# EAGLE design BedLevelSensor (EAGLE 9.6.2)
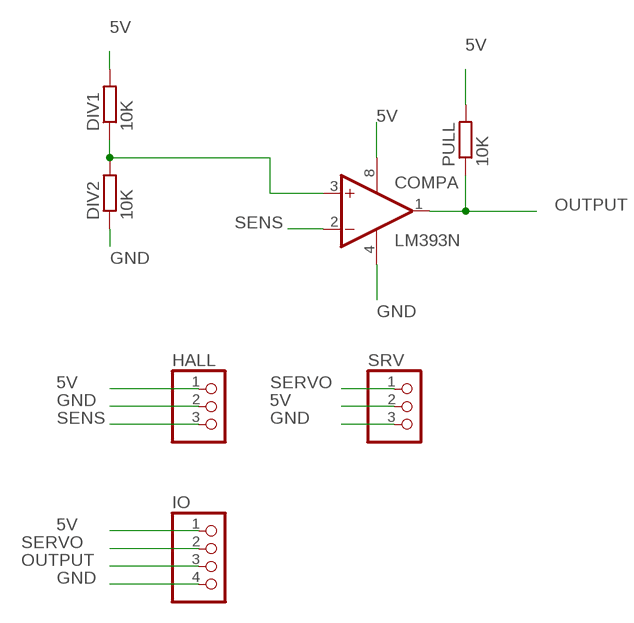
[diagram p0: schematic, sheet 1]

## Parts
COMP  LM393N  [DIL08]
DIV1  10K  R-EU_0204/5  [0204/5]
DIV2  10K  R-EU_0204/5  [0204/5]
HALL  PINHD-1X3  [1X03]
IO  PINHD-1X4  [1X04]
PULL  10K  R-EU_0204/5  [0204/5]
SRV  PINHD-1X3  [1X03]

## Nets
5V: COMP.8(P:V+) DIV1.2 HALL.1 IO.1 PULL.2 SRV.2
GND: COMP.4(P:V-) DIV2.1 HALL.2 IO.4 SRV.3
N$1: COMP.3(A:+IN) DIV1.1 DIV2.2
OUTPUT: COMP.1(A:OUT) IO.3 PULL.1
SENS: COMP.2(A:-IN) HALL.3
SERVO: IO.2 SRV.1
Unconnected: COMP.5(B:+IN) COMP.6(B:-IN) COMP.7(B:OUT)

## Library data of the parts
COMP = linear4:LM393: COMPARATOR
DIV1 DIV2 PULL = rcl:R-EU_: RESISTOR, European symbol; SPICEPREFIX: R
HALL SRV = pinhead:PINHD-1X3: PIN HEADER
IO = pinhead:PINHD-1X4: PIN HEADER

## Board
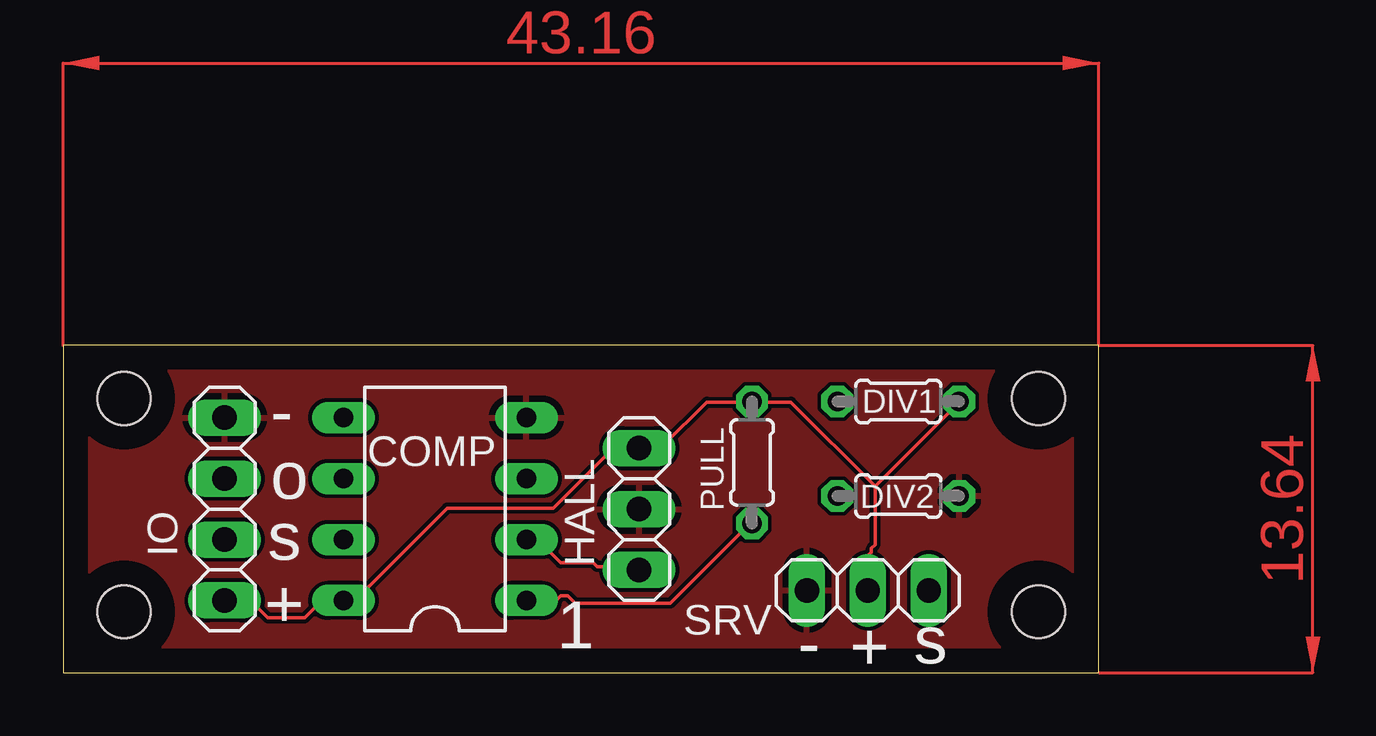
[diagram p1: board, top side]
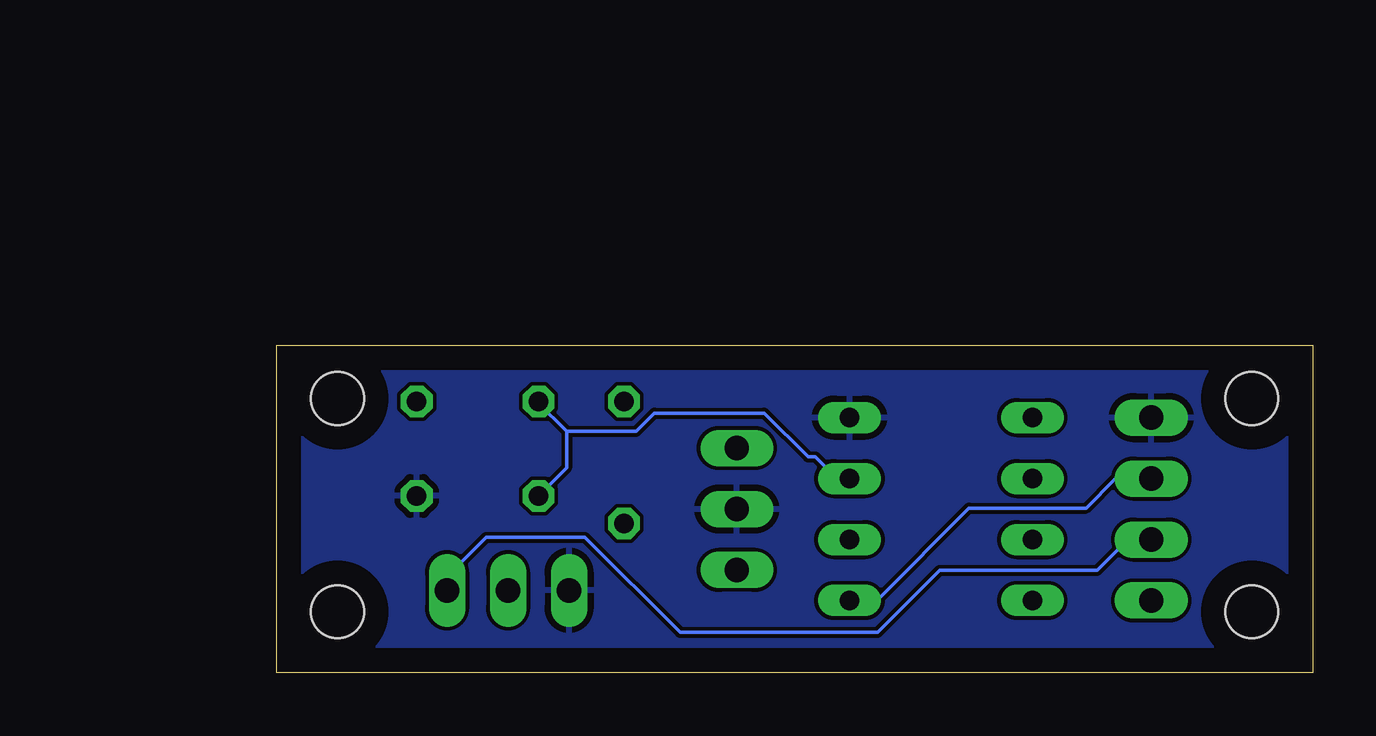
[diagram p2: board, bottom side, seen from below]

Size 43.16 x 13.64 mm. Coordinates in mm from the lower left corner, seen from the top.
Outline: 0,0 43.16,0 43.16,13.64 0,13.64 0,0
Copper layers (1*16): Top 0.035mm / dielectric 1.5mm / Bottom 0.035mm
Design rules "default": minimum track width 6mil, minimum drill 0.35mm, track to track 6mil, track to pad 6mil, pad to pad 6mil, via to via 6mil, smd to smd 6mil, copper to edge 40mil, drill to drill 6mil, minimum pad ring 10mil, minimum via ring 8mil, stop-mask expansion 4mil, vias tented up to drill 0mil, thermal gap 10mil
Holes 2.2 mm at 2.54,11.43 2.54,2.54 40.64,11.43 40.64,2.54

### Footprints (pad centres in the part's own frame; a part is rotated, then mirrored left to right if it is on the bottom)
DIL08 = drill 0.813 long: 1 -3.81,-3.81; 2 -1.27,-3.81; 3 1.27,-3.81; 4 3.81,-3.81; 5 3.81,3.81; 6 1.27,3.81; 7 -1.27,3.81; 8 -3.81,3.81
0204/5 = drill 0.813 octagon: 1 -2.54,0; 2 2.54,0
1X03 = drill 1.016 long: 1 -2.54,0; 2 0,0; 3 2.54,0
1X04 = drill 1.016 long: 1 -3.81,0; 2 -1.27,0; 3 1.27,0; 4 3.81,0

### Placement (x,y rotation side)
COMP  15.49,6.82 90 top
DIV1  34.8,11.3 0 top
DIV2  34.8,7.37 180 top
HALL  24,6.82 270 top
IO  6.73,6.82 90 top
PULL  28.7,8.76 90 top
SRV  33.53,3.43 180 top

### Tracks (layer width: path | path; a pad name or v marks a point on that pad's centre or on a via)
5V
  Top 0.152: 33.83,7.77 37.34,11.28 DIV1.2 | 33.83,7.77 33.83,5.33 33.68,5.18 33.68,5.03 33.53,4.88 SRV.2 | IO.1 6.86,2.9 7.92,2.9 8.53,2.29 10.06,2.29 10.67,2.9 11.58,2.9 COMP.8 11.73,3.05 12.19,3.05 16,6.86 20.42,6.86 22.86,9.3 23.93,9.3 HALL.1 24.08,9.45 24.99,9.45 26.82,11.28 28.65,11.28 PULL.2 28.8,11.28 30.33,11.28 33.83,7.77
GND
  pour Bottom: 0,13.97 43.18,13.97 43.18,0 0,0
  pour Top: 0,13.97 43.18,13.97 43.18,0 0,0
N$1
  Bottom 0.152: 31.09,10.06 28.19,10.06 27.43,10.82 22.86,10.82 21.03,8.99 20.73,8.99 19.96,8.23 19.36,8.23 COMP.3 | 31.09,10.06 32.31,11.28 DIV1.1 | DIV2.2 31.09,8.53 31.09,10.06
OUTPUT
  Top 0.152: COMP.1 19.36,3.05 20.57,3.05 20.73,3.2 21.03,3.2 21.34,2.9 25.3,2.9 28.65,6.25 PULL.1
  Bottom 0.152: IO.3 6.86,8.08 8.23,8.08 9.45,6.86 14.33,6.86 18.14,3.05 19.2,3.05 COMP.1
SENS
  Top 0.152: COMP.2 19.36,5.49 19.81,5.49 20.73,4.57 22.1,4.57 22.25,4.42 23.93,4.42 HALL.3
SERVO
  Bottom 0.152: IO.2 6.86,5.49 7.77,5.49 8.99,4.27 15.54,4.27 18.14,1.68 26.36,1.68 30.33,5.64 34.44,5.64 35.97,4.12 35.97,3.5 SRV.1
(copper drawn outside any net)
  shapes: Top area x2

### Text on the board
tPlace: - | o | s | + | 1 | - | + | s